# EAGLE design wing-pwr-board (EAGLE 5.04)
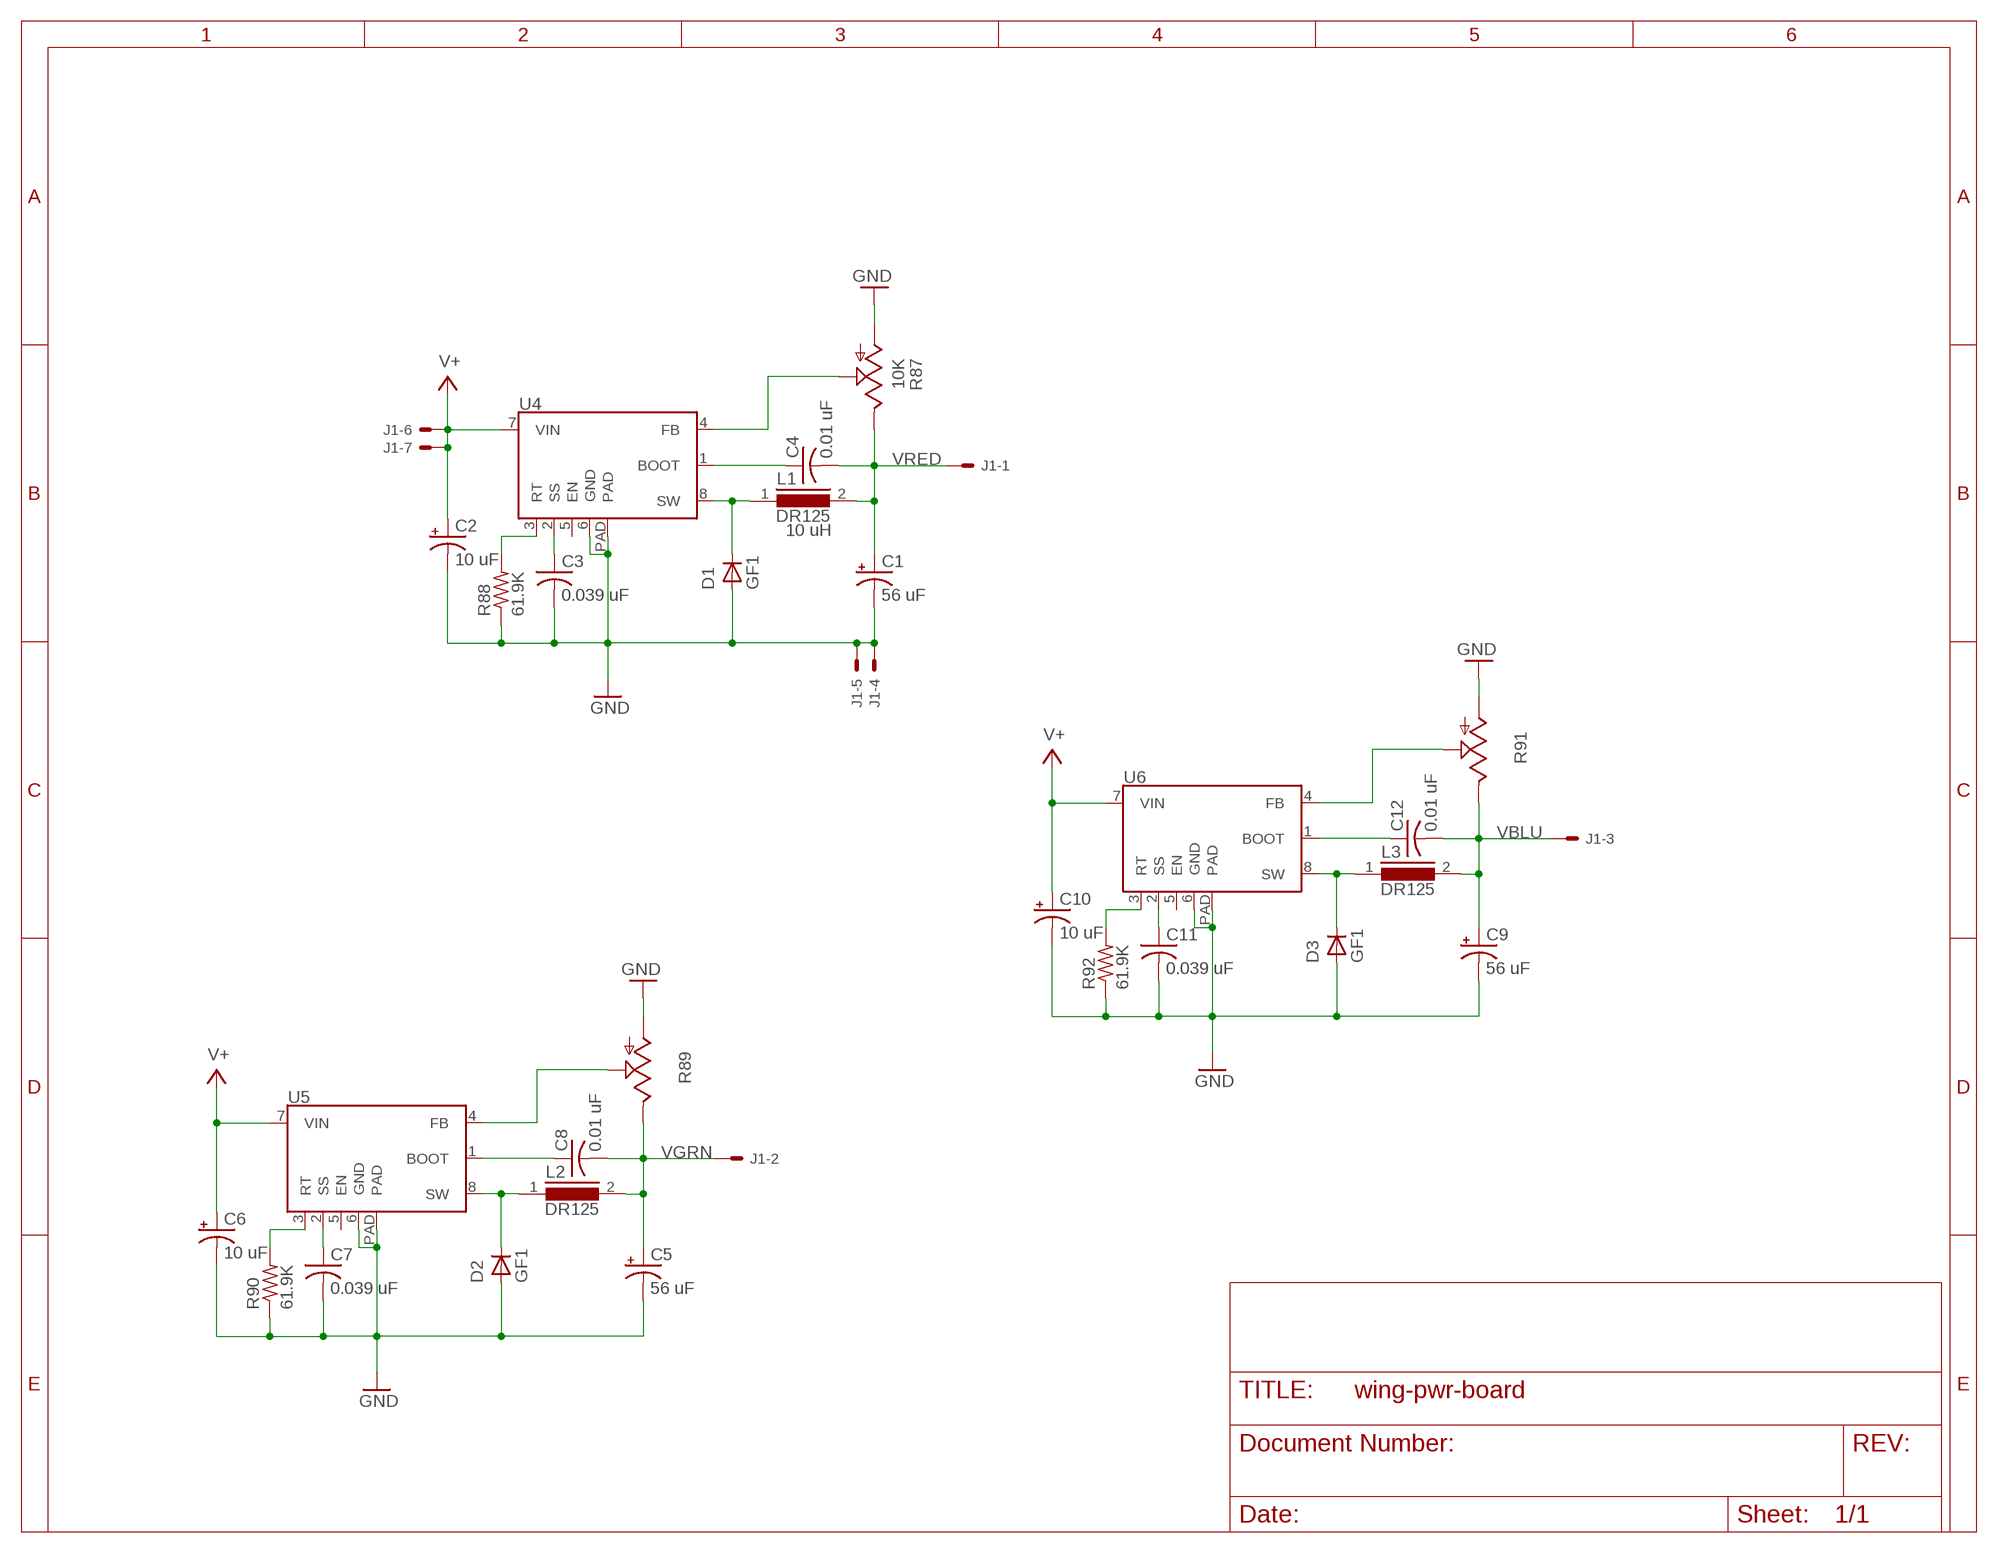
[diagram p0: schematic, sheet 1]

## Parts
C1  56 uF  CPOL-USD  [PANASONIC_D]
C2  10 uF  CPOL-USB  [PANASONIC_B]
C3  0.039 uF  C-USC1206  [C1206]
C4  0.01 uF  C-USC1206  [C1206]
C5  56 uF  CPOL-USD  [PANASONIC_D]
C6  10 uF  CPOL-USB  [PANASONIC_B]
C7  0.039 uF  C-USC1206  [C1206]
C8  0.01 uF  C-USC1206  [C1206]
C9  56 uF  CPOL-USD  [PANASONIC_D]
C10  10 uF  CPOL-USB  [PANASONIC_B]
C11  0.039 uF  C-USC1206  [C1206]
C12  0.01 uF  C-USC1206  [C1206]
D1  GF1  [SMA-DO214AC]
D2  GF1  [SMA-DO214AC]
D3  GF1  [SMA-DO214AC]
J1  5569-08A2  [5569-08A2]
L1  DR125  [DR125]
L2  DR125  [DR125]
L3  DR125  [DR125]
R87  10K  TRIM_US-CT6  [CT6]
R88  61.9K  R-US_R0603  [R0603]
R89  TRIM_US-CT6  [CT6]
R90  61.9K  R-US_R0603  [R0603]
R91  TRIM_US-CT6  [CT6]
R92  61.9K  R-US_R0603  [R0603]
U4  LM22680MR-ADJ  [PSOP8]
U5  LM22680MR-ADJ  [PSOP8]
U6  LM22680MR-ADJ  [PSOP8]

## Nets
GND [branch power]: C1.- C2.- C3.2 C5.- C6.- C7.2 C9.- C10.- C11.2 D1.A D2.A D3.A J1.4 J1.5 R87.A R88.1 R89.A R90.1 R91.A R92.1 U4.6(GND) U4.PAD U5.6(GND) U5.PAD U6.6(GND) U6.PAD
N$107 [main power]: D1.K(C) L1.1 U4.8(SW)
N$108: R88.2 U4.3(RT)
N$109 [main power]: C4.1 U4.1(BOOT)
N$110: C3.1 U4.2(SS)
N$111: R87.S U4.4(FB)
N$112 [main power]: D2.K(C) L2.1 U5.8(SW)
N$113 [main power]: C8.1 U5.1(BOOT)
N$114: C7.1 U5.2(SS)
N$115: R89.S U5.4(FB)
N$116: R90.2 U5.3(RT)
N$117 [main power]: D3.K(C) L3.1 U6.8(SW)
N$118 [main power]: C12.1 U6.1(BOOT)
N$119: C11.1 U6.2(SS)
N$120: R91.S U6.4(FB)
N$121: R92.2 U6.3(RT)
VBLU [main power]: C9.+ C12.2 J1.3 L3.2 R91.E
VGRN [main power]: C5.+ C8.2 J1.2 L2.2 R89.E
VIN [main power]: C2.+ C6.+ C10.+ J1.6 J1.7 U4.7(VIN) U5.7(VIN) U6.7(VIN) ; supply symbol labelled V+
VRED [main power]: C1.+ C4.2 J1.1 L1.2 R87.E
Unconnected: J1.8 U4.5(EN) U5.5(EN) U6.5(EN)

## Notes on the sheet
- 10 uH

## Library data of the parts
C1 C2 C5 C6 C9 C10 = rcl:CPOL-US: POLARIZED CAPACITOR, American symbol
C3 C4 C7 C8 C11 C12 = resistor:C-US: CAPACITOR, American symbol
D1-D3 = diode:GF1: DIODE
J1 = molex-minifitjr:5569-08A2
L1-L3 = inductors:DR125: High Power Density, High Efficiency, Shielded Inductors Source: coiltronics_dr_series.pdf
R87 R89 R91 = pot:TRIM_US-: POTENTIOMETER
R88 R90 R92 = resistor:R-US_: RESISTOR, American symbol
U4-U6 = nat-semi:LM22680

## Net classes
0 default: width 0.203 mm
1 main power: width 1.016 mm
2 branch power: width 0.305 mm

## Board
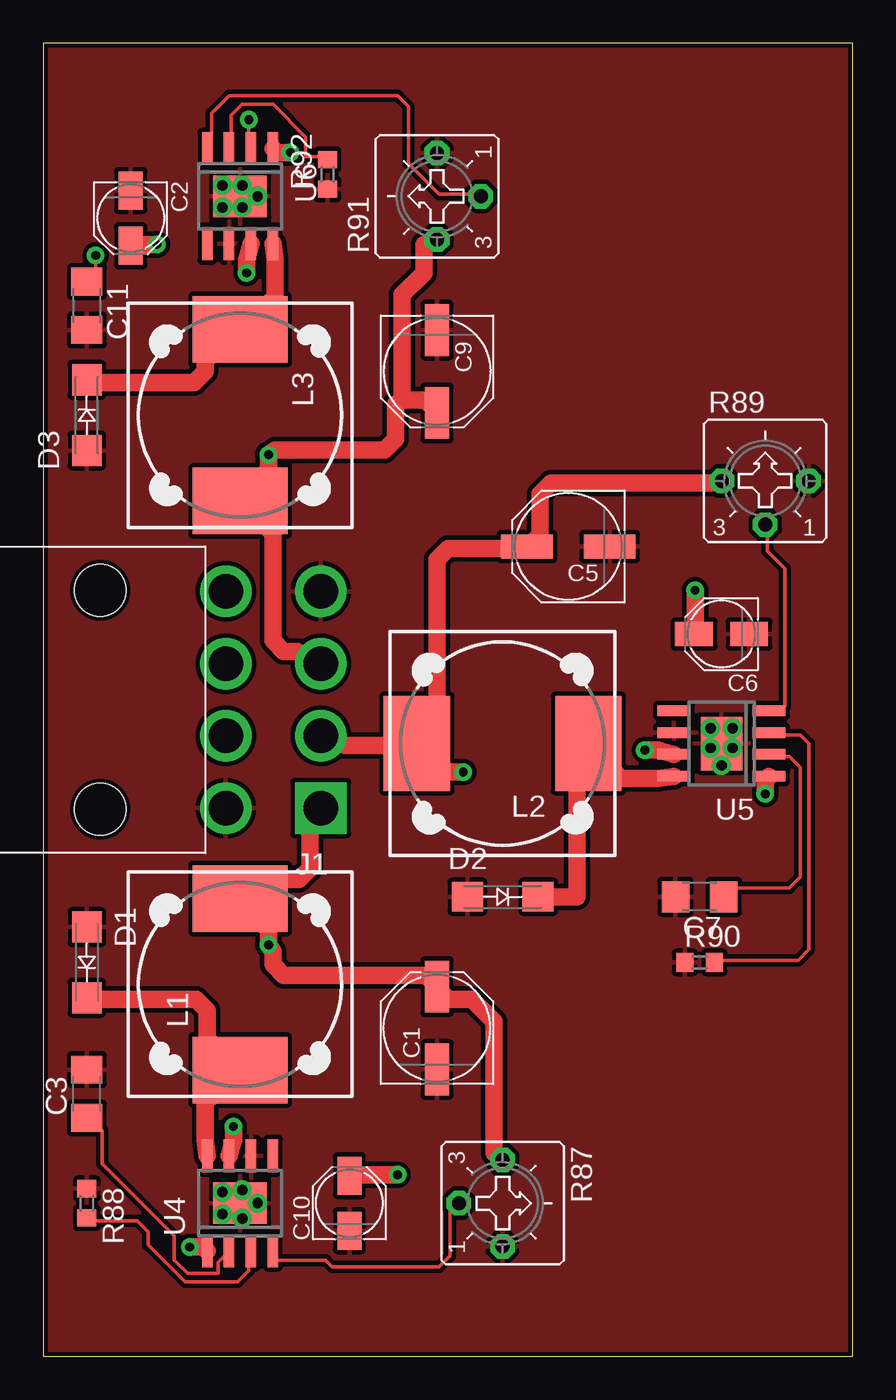
[diagram p1: board, top side]
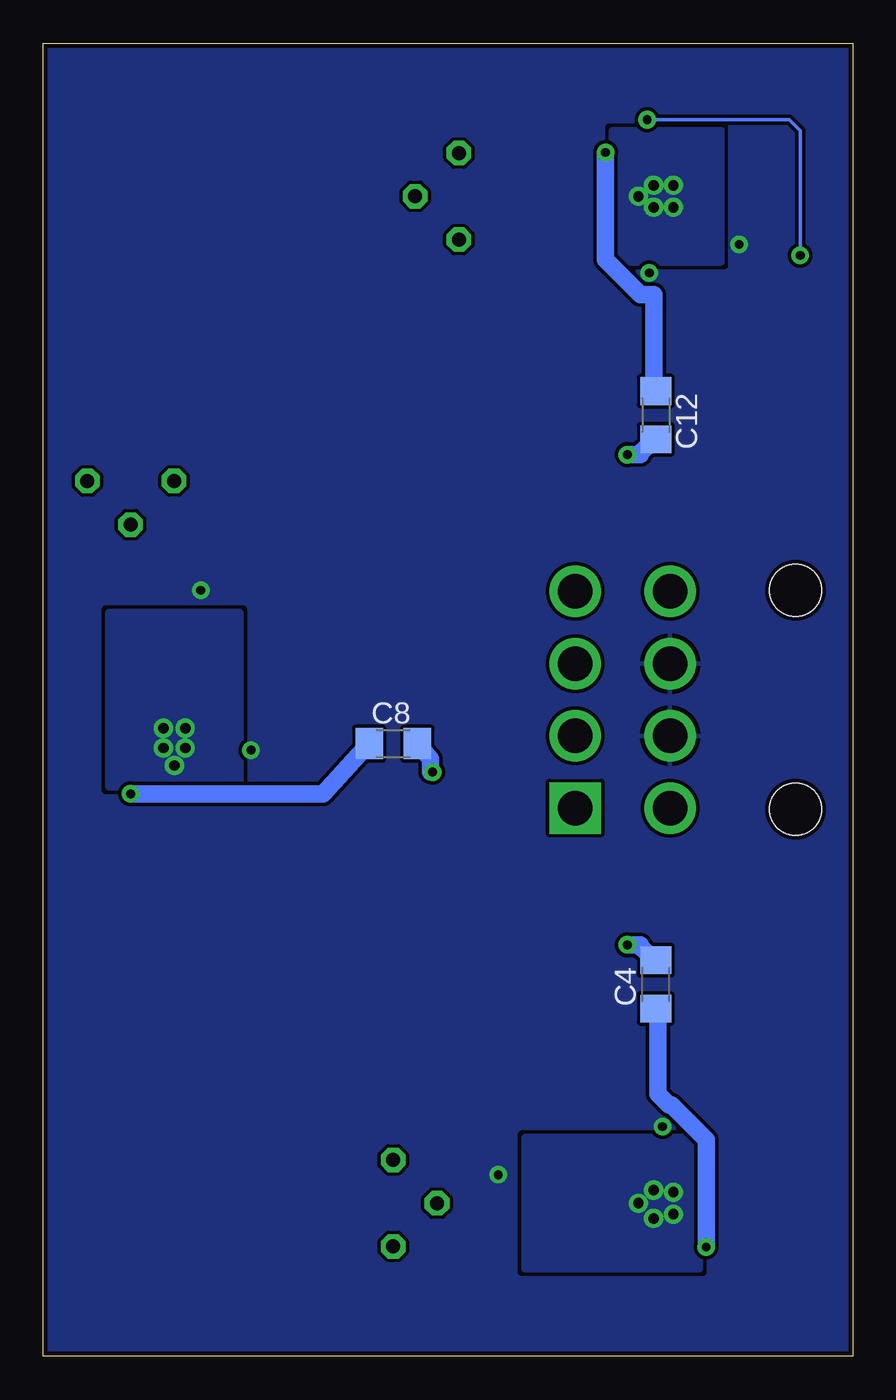
[diagram p2: board, bottom side, seen from below]

Size 46.99 x 76.2 mm. Coordinates in mm from the lower left corner, seen from the top.
Outline: 0,0 46.99,0 46.99,76.2 0,76.2 0,0
Copper layers (1*16): Top 0.035mm / dielectric 1.5mm / Bottom 0.035mm
Design rules "SparkFun": minimum track width 8mil, minimum drill 20mil, track to track 8mil, track to pad 8mil, pad to pad 8mil, via to via 8mil, smd to smd 8mil, copper to edge 10mil, drill to drill 8mil, minimum pad ring 12mil, minimum via ring 10mil, stop-mask expansion 4mil, vias tented up to drill 25mil, thermal gap 10mil

### Footprints (pad centres in the part's own frame; a part is rotated, then mirrored left to right if it is on the bottom)
PANASONIC_D = smd 3 x 1.4: + 2.4,0; - -2.4,0
PANASONIC_B = smd 2.2 x 1.4: + 1.6,0; - -1.6,0
C1206 = smd 1.6 x 1.8: 1 -1.4,0; 2 1.4,0
SMA-DO214AC = smd 1.8 x 1.7: A -2.05,0; K 2.05,0
5569-08A2 = drill 2 square: 1 -3.416,6.287 | drill 2 round: 2 -3.416,2.095; 3 -3.416,-2.095; 4 -3.416,-6.287; 5 2.095,6.287; 6 2.095,2.095; 7 2.095,-2.095; 8 2.095,-6.287 | hole 2.997: 9.385,6.35; 9.385,-6.35
DR125 = smd 3.85 x 5.5: 1 -4.975,0; 2 4.975,0
CT6 = drill 0.813 octagon: A 2.515,0; E -2.515,0; S 0,-2.54
R0603 = smd 1 x 1.1: 1 -0.85,0; 2 0.85,0
PSOP8 = smd 0.61 x 1.905: 1 -1.905,-2.756; 2 -0.635,-2.756; 3 0.635,-2.756; 4 1.905,-2.756; 5 1.905,2.756; 6 0.635,2.756; 7 -0.635,2.756; 8 -1.905,2.756 | smd 3.099 x 2.413: PAD 0,0

### Placement (x,y rotation side)
C1  22.86,19.05 90 top
C2  5.08,66.04 270 top
C3  2.54,15.24 90 top
C4  11.43,21.59 90 bottom
C5  30.48,46.99 180 top
C6  39.37,41.91 180 top
C7  38.1,26.67 180 top
C8  26.67,35.56 0 bottom
C9  22.86,57.15 270 top
C10  17.78,8.89 90 top
C11  2.54,60.96 270 top
C12  11.43,54.61 270 bottom
D1  2.54,22.86 270 top
D2  26.67,26.67 0 top
D3  2.54,54.61 90 top
J1  12.7,38.1 180 top
L1  11.43,21.59 90 top
L2  26.67,35.56 180 top
L3  11.43,54.61 270 top
R87  26.67,8.89 270 top
R88  2.54,8.89 270 top
R89  41.91,50.8 0 top
R90  38.1,22.86 0 top
R91  22.86,67.31 90 top
R92  16.51,68.58 90 top
U4  11.43,8.89 0 top
U5  39.37,35.56 90 top
U6  11.43,67.31 180 top

### Tracks (layer width: path | path; a pad name or v marks a point on that pad's centre or on a via)
GND  (via drill 0.6)
  other vias: 10.41,67.94 11.56,67.94 12.45,67.31 11.56,66.67 10.41,66.67 38.73,36.45 40.01,36.45 38.73,35.31 40.01,35.31 39.37,34.29 10.41,9.53 11.56,9.65 12.45,8.89 11.56,8 10.41,8.26
  pour Top (isolate 0.254): 0,76.2 46.99,76.2 46.99,0 0,0
  pour Bottom: 7.62,71.12 13.97,71.12 13.97,63.5 7.62,63.5
  pour Bottom: 35.56,43.18 35.56,33.02 43.18,33.02 43.18,43.18
  pour Bottom: 8.89,12.7 19.05,12.7 19.05,5.08 8.89,5.08
N$107
  Top 1.016: D1.K 3.3,20.7 8.89,20.7 9.53,20.07 9.53,18.41 L1.1 9.4,14.73 9.4,12.57 U4.8
N$108
  Top 0.203: R88.2 3.05,7.87 5.46,7.87 6.1,7.24 6.1,6.48 8.26,4.32 11.3,4.32 11.94,4.95 11.94,5.21 U4.3
N$109  (via drill 0.51)
  Top 1.016: v8.51,6.35 9.27,6.35 U4.1
  Bottom 1.016: v8.51,6.35 8.51,12.57 10.54,14.61 10.67,14.61 11.3,15.24 11.3,19.43 C4.1
N$110
  Top 0.203: C3.1 3.43,13.08 3.43,11.18 7.62,6.99 7.62,5.59 8.38,4.83 10.16,4.83 10.16,5.46 10.54,5.84 U4.2
N$111
  Top 0.203: U4.4 13.59,5.59 16.38,5.59 16.76,5.21 22.99,5.21 23.62,5.84 23.62,8.51 R87.S
N$112
  Top 1.016: D2.K 30.99,26.67 30.99,32.89 L2.1 33.53,33.53 35.69,33.53 U5.8
N$113  (via drill 0.51)
  Top 1.016: v41.91,32.64 41.91,33.4 U5.1
  Bottom 1.016: v41.91,32.64 30.73,32.64 C8.1
N$114
  Top 0.203: C7.1 40.26,27.18 43.31,27.18 43.94,27.81 43.94,34.16 43.31,34.8 43.05,34.8 U5.2
N$115
  Top 0.203: U5.4 43.05,37.72 43.05,45.72 42.04,46.74 42.04,47.62 R89.S
N$116
  Top 0.203: R90.2 39.37,22.99 43.81,22.99 44.45,23.62 44.45,35.56 43.94,36.07 43.05,36.07 U5.3
N$117
  Top 1.016: D3.K 3.3,56.52 8.76,56.52 9.4,57.15 9.4,57.78 L3.1 13.46,61.47 13.46,63.63 U6.8
N$118  (via drill 0.51)
  Top 1.016: v14.35,69.85 13.59,69.85 U6.1
  Bottom 1.016: v14.35,69.85 14.35,63.63 12.32,61.59 11.56,61.59 11.56,56.77 C12.1
N$119  (via drill 0.51)
  Top 0.203: v3.05,63.88 3.05,63.12 C11.1 | v11.94,71.75 11.94,70.99 U6.2
  Bottom 0.203: v3.05,63.88 3.05,71.12 3.68,71.75 v11.94,71.75
N$120
  Top 0.203: U6.4 9.78,70.99 9.78,72.14 10.79,73.15 20.57,73.15 21.21,72.52 21.21,69.22 22.99,67.44 24.77,67.44 R91.S
N$121
  Top 0.203: R92.2 16,69.6 15.24,69.6 15.24,70.74 13.34,72.64 11.56,72.64 10.92,72.01 10.92,70.99 U6.3
VBLU  (via drill 0.51)
  Top 1.016: 20.83,55.5 20.83,61.59 22.1,62.87 22.1,64.52 22.23,64.52 R91.E | 20.83,55.5 22.23,55.5 C9.+ | 20.83,55.5 20.45,55.24 20.45,53.21 19.81,52.58 13.46,52.58 v13.08,52.32 13.08,51.44 L3.2 13.34,47.75 13.34,41.53 13.97,40.89 14.73,40.89 J1.3
  Bottom 1.016: v13.08,52.32 12.32,52.32 12.32,52.45 C12.2
VGRN  (via drill 0.51)
  Top 1.016: R89.E 38.73,50.67 29.46,50.67 28.83,50.04 28.83,47.62 C5.+ 26.67,46.86 23.5,46.86 22.86,46.23 22.86,38.23 L2.2 | v24.38,33.91 23.5,33.91 L2.2 | L2.2 19.81,35.43 17.53,35.43 J1.2
  Bottom 1.016: v24.38,33.91 24.51,33.91 24.51,34.67 C8.2
VIN  (via drill 0.51)
  Top 1.016: v11.05,13.34 11.05,12.57 U4.7 | v11.81,62.87 11.81,63.63 U6.7 | v34.92,35.18 35.69,35.18 U5.7 | v20.57,10.54 18.41,10.54 C10.+ | v6.6,64.52 5.71,64.52 C2.+ | v37.85,44.45 37.85,42.55 C6.+
  pour Bottom (rank 2): 0,76.2 46.99,76.2 46.99,0 0,0
VRED  (via drill 0.51)
  Top 1.016: R87.E 26.16,11.81 26.16,19.43 24.89,20.7 23.5,20.7 C1.+ 22.23,22.1 13.97,22.1 13.34,22.73 13.34,23.5 v13.08,23.88 13.08,24.77 L1.2 14.1,27.69 14.86,27.69 15.49,28.32 15.49,30.35 J1.1
  Bottom 1.016: v13.08,23.88 12.32,23.88 12.32,23.75 C4.2